# Altium schematic sheet DIO-SMA_Supply.SchDoc: DIO-SMA
size 420 x 297 mm; Author: G.Kasprowicz; CompanyName: WUT ISE; DrawnBy: G.Kasprowicz; Organization: WUT ISE; Address1: PW ISE; Address2: Nowowiejska 15/19 00-665 Warsaw; Address3: gkasprow@gmail.com; DocumentNumber: 2; SheetNumber: 2; SheetTotal: 2; ModifiedBy: -; CheckedDate: -; DivGrp: WUT ISE; Designer: G.Kasprowicz; ModifiedDate: -; ProjectName: Sensor Box
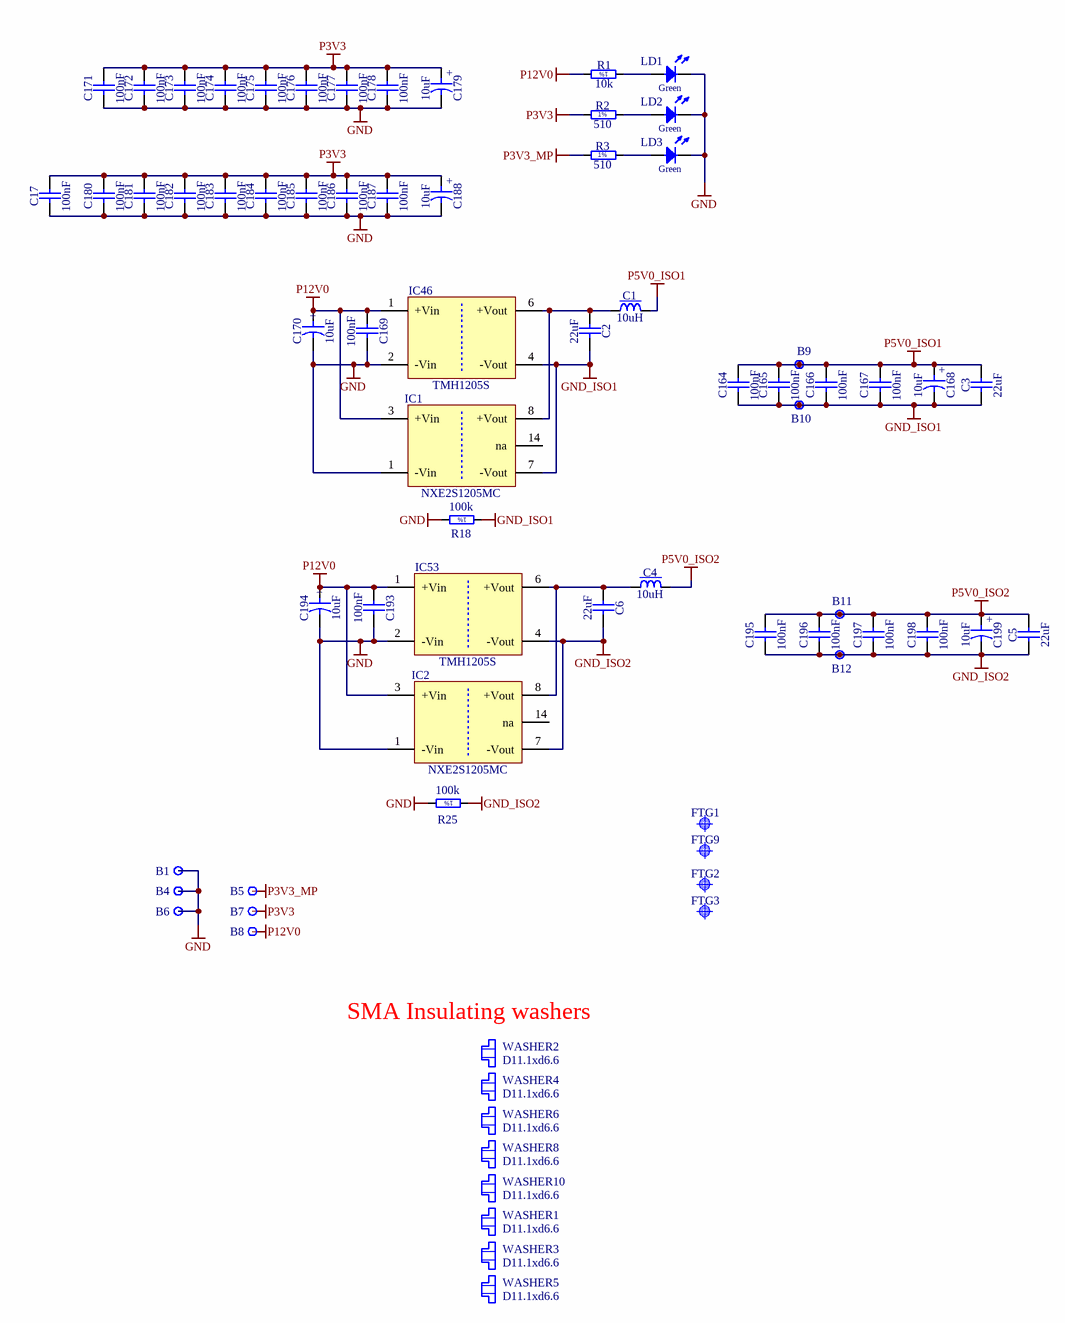
[diagram p0: DIO-SMA_Supply.SchDoc]

## Parts
B1  Plated Hole  [c130h60]  (value not drawn)  (no BOM)
B4  Plated Hole  [c130h60]  (value not drawn)  (no BOM)
B5  Plated Hole  [c130h60]  (value not drawn)  (no BOM)
B6  Plated Hole  [c130h60]  (value not drawn)  (no BOM)
B7  Plated Hole  [c130h60]  (value not drawn)  (no BOM)
B8  Plated Hole  [c130h60]  (value not drawn)  (no BOM)
B9  Plated Hole  [c130h60]  (value not drawn)  (no BOM)
B10  Plated Hole  [c130h60]  (value not drawn)  (no BOM)
B11  Plated Hole  [c130h60]  (value not drawn)  (no BOM)
B12  Plated Hole  [c130h60]  (value not drawn)  (no BOM)
C1  10uH  [IND_MURATA-PS_8400]
C2  22uF  [CAPC2012X135N]
C3  22uF  [CAPC2012X135N]
C4  10uH  [IND_MURATA-PS_8400]
C5  22uF  [CAPC2012X135N]
C6  22uF  [CAPC2012X135N]
C17  100nF  [CAPC1005X55N]
C164  100nF  [CAPC1005X55N]
C165  100nF  [CAPC1005X55N]
C166  100nF  [CAPC1005X55N]
C167  100nF  [CAPC1005X55N]
C168  10uF  [CAPAE430X540N]
C169  100nF  [CAPC1005X55N]
C170  10uF  [CAPAE430X540N]
C171  100nF  [CAPC1005X55N]
C172  100nF  [CAPC1005X55N]
C173  100nF  [CAPC1005X55N]
C174  100nF  [CAPC1005X55N]
C175  100nF  [CAPC1005X55N]
C176  100nF  [CAPC1005X55N]
C177  100nF  [CAPC1005X55N]
C178  100nF  [CAPC1005X55N]
C179  10uF  [CAPAE430X540N]
C180  100nF  [CAPC1005X55N]
C181  100nF  [CAPC1005X55N]
C182  100nF  [CAPC1005X55N]
C183  100nF  [CAPC1005X55N]
C184  100nF  [CAPC1005X55N]
C185  100nF  [CAPC1005X55N]
C186  100nF  [CAPC1005X55N]
C187  100nF  [CAPC1005X55N]
C188  10uF  [CAPAE430X540N]
C193  100nF  [CAPC1005X55N]
C194  10uF  [CAPAE430X540N]
C195  100nF  [CAPC1005X55N]
C196  100nF  [CAPC1005X55N]
C197  100nF  [CAPC1005X55N]
C198  100nF  [CAPC1005X55N]
C199  10uF  [CAPAE430X540N]
FTG1  Use only in PCB  [FIDUCIAL_TOP_C100-200]  (value not drawn)  (no BOM)
FTG2  Use only in PCB  [FIDUCIAL_TOP_C100-200]  (value not drawn)  (no BOM)
FTG3  Use only in PCB  [FIDUCIAL_TOP_C100-200]  (value not drawn)  (no BOM)
FTG9  Use only in PCB  [FIDUCIAL_TOP_C100-200]  (value not drawn)  (no BOM)
IC1  NXE2S1205MC  [DCDC_MURATA_NXE2]
IC2  NXE2S1205MC  [DCDC_MURATA_NXE2]
IC46  TMH1205S  [DCDC_TRACO_TMA]
IC53  TMH1205S  [DCDC_TRACO_TMA]
LD1  Green  [LED_KINGBRIGHT_KPH-1608CGCK]  (value not drawn)
LD2  Green  [LED_KINGBRIGHT_KPH-1608CGCK]  (value not drawn)
LD3  Green  [LED_KINGBRIGHT_KPH-1608CGCK]  (value not drawn)
R1  10k  [RESC1005X40N]
R2  510  [RESC1005X40N]
R3  510  [RESC1005X40N]
R18  100k  [RESC2012X60N]
R25  100k  [RESC2012X60N]
WASHER1  D11.1xd6.6  [Keystone_7687]
WASHER2  D11.1xd6.6  [Keystone_7687]
WASHER3  D11.1xd6.6  [Keystone_7687]
WASHER4  D11.1xd6.6  [Keystone_7687]
WASHER5  D11.1xd6.6  [Keystone_7687]
WASHER6  D11.1xd6.6  [Keystone_7687]
WASHER8  D11.1xd6.6  [Keystone_7687]
WASHER10  D11.1xd6.6  [Keystone_7687]

## Nets
GND: B1.1 B4.1 B6.1 C17.1 C169.1 C170.2 C171.1 C172.1 C173.1 C174.1 C175.1 C176.1 C177.1 C178.1 C179.2 C180.1 C181.1 C182.1 C183.1 C184.1 C185.1 C186.1 C187.1 C188.2 C193.1 C194.2 IC1.1(-Vin) IC2.1(-Vin) IC46.2(-Vin) IC53.2(-Vin) LD1.1(C) LD2.1(C) LD3.1(C) R18.2 R25.2
GND_ISO1: B10.1 C2.1 C3.1 C164.1 C165.1 C166.1 C167.1 C168.2 IC1.7(-Vout) IC46.4(-Vout) R18.1
GND_ISO2: B12.1 C5.1 C6.1 C195.1 C196.1 C197.1 C198.1 C199.2 IC2.7(-Vout) IC53.4(-Vout) R25.1
P3V3: B7.1 C17.2 C171.2 C172.2 C173.2 C174.2 C175.2 C176.2 C177.2 C178.2 C179.1 C180.2 C181.2 C182.2 C183.2 C184.2 C185.2 C186.2 C187.2 C188.1 R2.1
P3V3_MP: B5.1 R3.1
P5V0_ISO1: B9.1 C1.1 C3.2 C164.2 C165.2 C166.2 C167.2 C168.1
P5V0_ISO2: B11.1 C4.1 C5.2 C195.2 C196.2 C197.2 C198.2 C199.1
P12V0: B8.1 C169.2 C170.1 C193.2 C194.1 IC1.3(+Vin) IC2.3(+Vin) IC46.1(+Vin) IC53.1(+Vin) R1.2
NetC1_2: C1.2 C2.2 IC1.8(+Vout) IC46.6(+Vout)
NetC4_2: C4.2 C6.2 IC2.8(+Vout) IC53.6(+Vout)
NetLD1_2: LD1.2(A) R1.1
NetLD2_2: LD2.2(A) R2.2
NetLD3_2: LD3.2(A) R3.2

Not connected (* = marked no-connect by the designer): IC1 14(na); IC2 14(na)

## Notes on the sheet
- (near WASHER2) SMA Insulating washers
- Project/Equipment
- Document
- Designer
- Drawn by
- Check.by
- Copyright WUT ISE 2020.
  This documentation describes Open Hardware and is licensed under the CERN OHL v.1.2. You may redistribute and modify this documentation under the terms of the CERN OHL v.1.2. (http://ohwr.org/CERNOHL). This documentation is distributed WITHOUT ANY EXPRESS OR IMPLIED WARRANTY, INCLUDING OF MERCHANTABILITY, SATISFACTORY QUALITY AND FITNESS FOR A PARTICULAR PURPOSE. Please see the CERN OHL v.1.2 for applicable conditions.
- Contact
- File
- Last Mod.
- Print Date
- Sheet
- Size
- A3
- of
- Rev
- (in symbol CAE430-540_10UF_16V_20%) +
- (in symbol R0402_10K_1%_0.0625W_100PPM) 1%
- (in symbol R0402_510R_1%_0.0625W_100PPM) 1%
- (in symbol R0805_100K_1%_0.125W_100PPM) 1%

## Library data of the parts
B1 B4-B12 = PLATED_HOLE0.6_PAD1.3: Single Terminal Socket; Part Description: Plated Through Hole: Hole Dia.=0.6mm Pad Dia.=1.3mm; Mounted: No; Part Number: PLATED_HOLE0.6_PAD1.3; Component Type: Standard (No BOM); Pin Count: 1; Family: Plated Hole; Socket: No; SMD: No; Sense: No; Status: None; ComponentHeight: 0mm; HelpURL: Undefined; Author: CERN DEM MR; CreateDate: 02.03.2016; LatestRevisionDate: 02.03.2016; PackageDescription: Plated Through Hole: Hole Dia.=0.6mm Pad Dia.=1.3mm
C1 C4 = IND_10UH_10%_MURATA-PS_8400: Inductor With Core; Part Description: Miniature Surface Mount Power Inductor (8400 Serie); Manufacturer: MURATA POWER SOLUTIONS; Manufacturer Part Number: 84103C; Power: 950mA; Resistance: 0.24R; Tolerance: ±10%; Part Number: IND_10UH_10%_MURATA-PS_8400; Component Kind: Standard; Component Type: Standard; Pin Count: 2; Value: 10uH; Status: None; Mounted: Yes; Socket: No; SMD: Yes; Sense: No; ComponentHeight: 2.9mm; HelpURL: \\cern.ch\dfs\Applications\Altium\Datasheets\IND_MURATA-PS_8400.pdf; Author: CERN DEM JLC; CreateDate: 02.07.2012; LatestRevisionDate: 02.07.2012
C2 C3 C5 C6 = CC0805_22UF_16V_10%_X5R: Non-polarised capacitor; Part Description: SMD Multilayer Chip Ceramic Capacitor; Manufacturer: GENERIC; Manufacturer1 Part Number: C2012X5R1C226KT; Voltage: 16V; TC: X5R; Tolerance: ±10%; Part Number: CC0805_22UF_16V_10%_X5R; Component Kind: Standard; Component Type: Standard; Pin Count: 2; Value: 22uF; Status: Preferred; Manufacturer Part Number: CC0805_22UF_16V_10%_X5R; Case: 0805; Mounted: Yes; Socket: No; SMD: Yes; Sense: No; Manufacturer1 Example: TDK; Manufacturer1 ComponentHeight: 1.35mm; HelpURL: \\cern.ch\dfs\Applications\Altium\Datasheets\CC0805_X5R_TDK_C.pdf; Author: CERN DEM JLC; CreateDate: 25.10.2012; LatestRevisionDate: 25.10.2012
C17 C164-C167 C169 C171-C178 C180-C187 C193 C195-C198 = CC0402_100NF_16V_10%_X5R: Non-polarised capacitor; Part Description: SMD Multilayer Chip Ceramic Capacitor; Manufacturer: GENERIC; Manufacturer1 Part Number: GRM155R61C104KA88D; Voltage: 16V; TC: X5R; Tolerance: ±10%; Part Number: CC0402_100NF_16V_10%_X5R; Component Kind: Standard; Component Type: Standard; Pin Count: 2; Value: 100nF; Status: None; Manufacturer Part Number: CC0402_100NF_16V_10%_X5R; Case: 0402; Mounted: Yes; Socket: No; SMD: Yes; Sense: No; Manufacturer1 Example: MURATA; Manufacturer1 ComponentHeight: 0.55mm; HelpURL: \\cern.ch\dfs\Applications\Altium\Datasheets\CC0402_X5R_MURATA_GRM.pdf; Author: CERN DEM JLC; CreateDate: 10.12.2013; LatestRevisionDate: 10.12.2013
C168 C170 C179 C188 C194 C199 = CAE430-540_10UF_16V_20%: Polarised capacitor; Part Description: Aluminum Electrolytic SMT Capacitor; Manufacturer: PANASONIC; Manufacturer Part Number: EEEFK1C100AR; Voltage: 16V; Tolerance: ±20%; Part Number: CAE430-540_10UF_16V_20%; Component Kind: Standard; Component Type: Standard; Pin Count: 2; Value: 10uF; Status: Not Recommended; Case: B; Mounted: Yes; Socket: No; SMD: Yes; Sense: No; ComponentHeight: 5.8mm; HelpURL: \\cern.ch\dfs\Applications\Altium\Datasheets\CAE_PANASONIC_FK.pdf; Author: CERN DEM JLC; CreateDate: 03.12.2007; LatestRevisionDate: 05.11.2014
FTG1-FTG3 FTG9 = FIDUCIAL_TARGET_C100-200: Fiducial Target; Part Description: Round Fiducial Target, Top Layer, 1.0mm, Top Solder 2.0mm, Keepout =2.0mm; Mounted: No; Part Number: FIDUCIAL_TARGET_C100-200; Component Type: Standard (No BOM); Pin Count: 1; Family: Fiducial; Socket: No; SMD: Yes; Sense: No; Status: None; ComponentHeight: 0mm; HelpURL: Undefined; Author: CERN DEM JLC; CreateDate: 09.02.2010; LatestRevisionDate: 04.04.2012; PackageDescription: Round Fiducial Target, Top Layer, 1.0mm, Top Solder 2.0mm, Keepout =2.0mm
IC1 IC2 = DCDC_MURATA_NXE2S1205MC: MURATA, NXE2 Serie, Dual Output DCDC Converter; Part Description: 12V to 5V, Iout (max) 400mA, 3kVDC Isolated, 2W Dual Output DC-DC Converter; Manufacturer: MURATA POWER SOLUTIONS; PressFit: No; Bonding: No; Part Number: NXE2S1205MC; Component Kind: Standard; Component Type: Standard; Device: NXE2S1205MC; PackageDescription: NXE2 Series, Body 12.7 x 10.4, Height 4.4mm; Manufacturer Part Number: NXE2S1205MC; Pin Count: 5; Mounted: Yes; Socket: No; SMD: Yes; Sense: No; ComponentHeight: 4.4mm; HelpURL: \\cern.ch\dfs\Applications\Altium\Datasheets\MTU1D1215MC.pdf; Author: CERN DEM MR; CreateDate: 16.01.2017; LatestRevisionDate: 16.01.2017
IC46 IC53 = DC/DC_TRACO_TMH1205S: 12V ±10% to 5V, Iout (max) 400mA, 2W DC-DC Converter; Manufacturer: TRACO POWER; PressFit: No; Bonding: No; Part Number: TMH1205S; Component Kind: Standard; Component Type: Standard; Device: TMH1205S; PackageDescription: TMA Series, Body 19.5x6.1mm, SIP-6, Unregulated; Part Description: 12V ±10% to 5V, Iout (max) 400mA, 2W DC-DC Converter; Manufacturer Part Number: TMH1205S; Pin Count: 4; Mounted: Yes; Socket: No; SMD: No; Sense: No; ComponentHeight: 10.45mm; HelpURL: \\cern.ch\dfs\Applications\Altium\Datasheets\TMA 0505S.pdf; Author: GK; CreateDate: 17.12.2016; LatestRevisionDate: 17.12.2016
LD1-LD3 = LED_KINGBRIGHT_KPH-1608CGCK: LED Green 1C 2A; Part Description: SMD Green LED, Case 1.6mmX0.8mm(0603), 0.65mm Thickness; PressFit: No; Bonding: No; Part Number: LED_KINGBRIGHT_KPH-1608CGCK; Component Kind: Standard; Component Type: Standard; Color: Green; PackageDescription: SMT Green LED, Case 0603, Body L 1.6 x W 0.8mm H 0.65mm; Manufacturer: KINGBRIGHT; Manufacturer Part Number: KPH-1608CGCK; Pin Count: 2; Mounted: Yes; Socket: No; SMD: Yes; Sense: No; ComponentHeight: 0.65mm; HelpURL: \\cern.ch\dfs\Applications\Altium\Datasheets\LED_KINGBRIGHT_KPH-1608CGCK.pdf; Author: CERN DEM JLC; CreateDate: 03.07.2017; LatestRevisionDate: 03.07.2017
R1 = R0402_10K_1%_0.0625W_100PPM: Resistor - 1%; Part Description: General Purpose Thick Film Chip Resistor; Manufacturer: GENERIC; Manufacturer1 Part Number: 232270671003L; TC: ±100ppm/°C; Part Number: R0402_10K_1%_0.0625W_100PPM; Component Kind: Standard; Component Type: Standard; Pin Count: 2; Value: 10k; Status: Not recommended; Power: 0.0625W; Tolerance: ±1%; Manufacturer Part Number: R0402_10K_1%_0.0625W_100PPM; Case: 0402; Mounted: Yes; Sense: No; Socket: No; SMD: Yes; Manufacturer1 Example: YAGEO PHYCOMP; Manufacturer1 ComponentHeight: 0.4mm; HelpURL: \\cern.ch\dfs\Applications\Altium\Datasheets\R0402_Phycomp_RC0402.pdf; Author: CERN DEM JLC; CreateDate: 03.12.2007; LatestRevisionDate: 17.10.2012
R2 R3 = R0402_510R_1%_0.0625W_100PPM: Resistor - 1%; Part Description: General Purpose Thick Film Chip Resistor; Manufacturer: GENERIC; Manufacturer1 Part Number: 232270675101L; TC: ±100ppm/°C; Part Number: R0402_510R_1%_0.0625W_100PPM; Component Kind: Standard; Component Type: Standard; Pin Count: 2; Value: 510; Status: Not recommended; Power: 0.0625W; Tolerance: ±1%; Manufacturer Part Number: R0402_510R_1%_0.0625W_100PPM; Case: 0402; Mounted: Yes; Sense: No; Socket: No; SMD: Yes; Manufacturer1 Example: YAGEO PHYCOMP; Manufacturer1 ComponentHeight: 0.4mm; HelpURL: \\cern.ch\dfs\Applications\Altium\Datasheets\R0402_Phycomp_RC0402.pdf; Author: CERN DEM JLC; CreateDate: 03.12.2007; LatestRevisionDate: 17.10.2012
R18 R25 = R0805_100K_1%_0.125W_100PPM: Resistor - 1%; Part Description: General Purpose Thick Film Chip Resistor; Manufacturer: GENERIC; Manufacturer1 Part Number: NRC10F1003TRF; Power: 0.125W; TC: ±100ppm/°C; PressFit: No; Part Number: R0805_100K_1%_0.125W_100PPM; Component Kind: Standard; Component Type: Standard; Pin Count: 2; Value: 100k; Status: Preferred; Tolerance: ±1%; Manufacturer Part Number: R0805_100K_1%_0.125W_100PPM; Case: 0805; Mounted: Yes; Sense: No; Socket: No; SMD: Yes; Manufacturer1 Example: NIC COMPONENT; Manufacturer1 ComponentHeight: 0.6mm; HelpURL: \\cern.ch\dfs\Applications\Altium\Datasheets\R0805_NIC_NRC.pdf; Author: CERN DEM JLC; CreateDate: 03.12.2007; LatestRevisionDate: 13.03.2008
WASHER1-WASHER6 WASHER8 WASHER10 = Keystone_7687: SMA_Shoulder Washer; Part Number: Custom 3D; Part Description: Polyphenylene Sulfide PPS Shoulder Washer; PressFit: No; Component Kind: Standard; Component Type: Mechanical; Footprint: Custom 3D; Pin Count: 0; PackageDescription: Polyphenylene Sulfide PPS Shoulder Washer; Mounted: Yes; Socket: No; SMD: No; Sense: No; Status: None; Value: D11.1xd6.6; Manufacturer: Custom 3D; Manufacturer Part Number: Custom 3D; ComponentHeight: 1.91mm; HelpURL: \\cern.ch\dfs\Applications\Altium\Datasheets\AAVID-THERMALLOY_7721-7PPSG.pdf; Author: GK; CreateDate: 28.01.2016; LatestRevisionDate: 28.01.2016